# Altium schematic sheet Power.SchDoc
size A
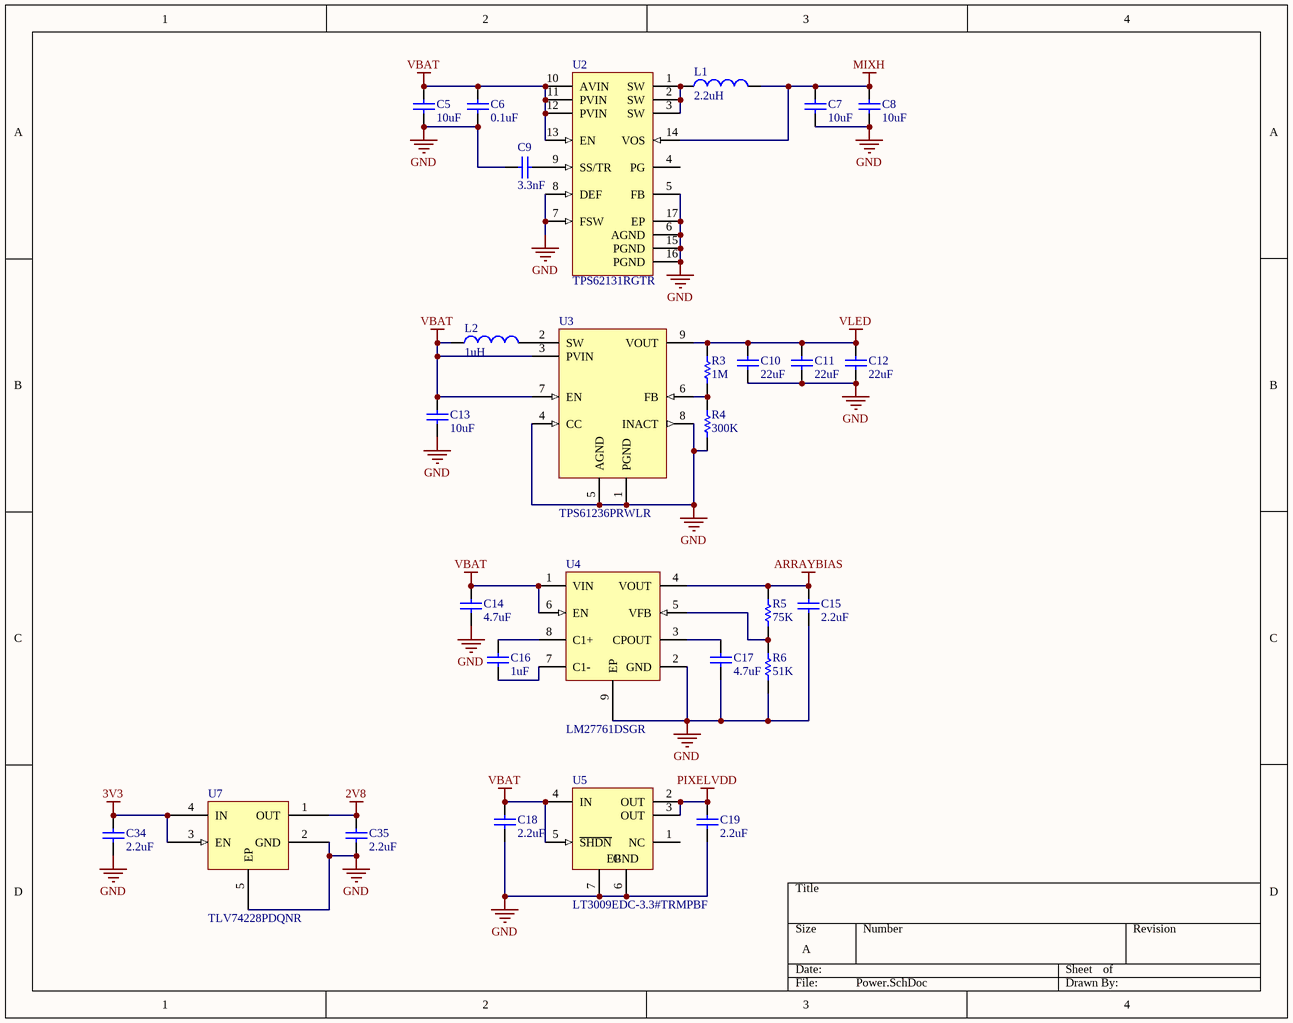
[diagram p0: Power.SchDoc]

## Parts
C5  value 10uF  [C0402[1005X55]]  (hidden comment: 10uF 6.3V 0402)
C6  value 0.1uF  [C0201[0603X30]]  (hidden comment: 0.1uF 6.3V 0201)
C7  value 10uF  [C0402[1005X55]]  (hidden comment: 10uF 6.3V 0402)
C8  value 10uF  [C0402[1005X55]]  (hidden comment: 10uF 6.3V 0402)
C9  value 3.3nF  [C0201[0603X30]]  (hidden comment: 3.3nF 6.3V 0201)
C10  value 22uF  [C0603[1608X92]]  (hidden comment: 22uF 6.3V 0603)
C11  value 22uF  [C0603[1608X92]]  (hidden comment: 22uF 6.3V 0603)
C12  value 22uF  [C0603[1608X92]]  (hidden comment: 22uF 6.3V 0603)
C13  value 10uF  [C0402[1005X55]]  (hidden comment: 10uF 6.3V 0402)
C14  value 4.7uF  [C0402[1005X55]]  (hidden comment: 4.7uF 6.3V 0402)
C15  value 2.2uF  [C0402[1005X55]]  (hidden comment: 2.2uF 6.3V 0402)
C16  value 1uF  [C0402[1005X55]]  (hidden comment: 1uF 6.3V 0402)
C17  value 4.7uF  [C0402[1005X55]]  (hidden comment: 4.7uF 6.3V 0402)
C18  value 2.2uF  [C0402[1005X55]]  (hidden comment: 2.2uF 6.3V 0402)
C19  value 2.2uF  [C0402[1005X55]]  (hidden comment: 2.2uF 6.3V 0402)
C34  value 2.2uF  [C0402[1005X55]]  (hidden comment: 2.2uF 6.3V 0402)
C35  value 2.2uF  [C0402[1005X55]]  (hidden comment: 2.2uF 6.3V 0402)
L1  2.2uH  [IND1008]
L2  1uH  [IND1008]
R3  value 1M  [R0402[1005]]  (hidden comment: 1M 1% 0402)
R4  value 300K  [R0402[1005]]  (hidden comment: 300K 1% 0402)
R5  value 75K  [R0402[1005]]  (hidden comment: 75K 1% 0402)
R6  value 51K  [R0402[1005]]  (hidden comment: 51K 1% 0402)
U2  TPS62131RGTR  [RGT0016C_V]
U3  TPS61236PRWLR  [VQFN-9]
U4  LM27761DSGR  [WSON-8]
U5  LT3009EDC-3.3#TRMPBF  [LT-DC6-6_V]
U7  TLV74228PDQNR  [X2SON-4]

## Nets
2V8: C35.2 U7.1(OUT)
3V3: C34.2 U7.3(EN) U7.4(IN)
ARRAYBIAS: C15.2 R5.2 U4.4(VOUT)
GND: C5.1 C6.1 C7.1 C8.1 C9.1 C10.1 C11.1 C12.1 C13.1 C14.1 C15.1 C17.1 C18.1 C19.1 C34.1 C35.1 R4.1 R6.1 U2.5(FB) U2.6(AGND) U2.7(FSW) U2.8(DEF) U2.15(PGND) U2.16(PGND) U2.17(EP) U3.1(PGND) U3.4(CC) U3.5(AGND) U3.8(INACT) U4.2(GND) U4.9(EP) U5.6(GND) U5.7(EP) U7.2(GND) U7.5(EP)
MIXH: C7.2 C8.2 L1.2 U2.14(VOS)
PIXELVDD: C19.2 U5.2(OUT) U5.3(OUT)
VBAT: C5.2 C6.2 C13.2 C14.2 C18.2 L2.1 U2.10(AVIN) U2.11(PVIN) U2.12(PVIN) U2.13(EN) U3.3(PVIN) U3.7(EN) U4.1(VIN) U4.6(EN) U5.4(IN) U5.5(~{SHDN})
VLED: C10.2 C11.2 C12.2 R3.2 U3.9(VOUT)
NetC9_2: C9.2 U2.9(SS/TR)
NetC16_1: C16.1 U4.7(C1-)
NetC16_2: C16.2 U4.8(C1+)
NetC17_2: C17.2 U4.3(CPOUT)
NetL1_1: L1.1 U2.1(SW) U2.2(SW) U2.3(SW)
NetL2_2: L2.2 U3.2(SW)
NetR3_1: R3.1 R4.2 U3.6(FB)
NetR5_1: R5.1 R6.2 U4.5(VFB)

Not connected (* = marked no-connect by the designer): U2 4(PG); U5 1(NC)

## Library data of the parts
C5 C7 C8 C13 = CAP_10uF_6.3V_0402_20%: 10uF 6.3V 20% 0402 (1005 Metric); PartNumber: GRM155R60J106ME44D; Manufacturer: Murata; Mounting Technology: Surface Mount; PackageReference: 0402; PackageDescription: 0402 (1005 Metric); Voltage: 6.3V; Tolerance: 20%
C6 = CAP_0.1uF_6.3V_0201_10%: 0.1uF 6.3V 10% 0201 (0603 Metric); PartNumber: GRT033R60J104KE01D; Manufacturer: Murata; Mounting Technology: Surface Mount; PackageReference: 0201; PackageDescription: 0201 (0603 Metric); Voltage: 6.3V; Tolerance: 10%
C9 = CAP_3,3nF_6.3V_0201_10%: 3.3nF 6.3V 10% 0201 (0603 Metric); PartNumber: GRM033R70J332KA01D; Manufacturer: Murata; Mounting Technology: Surface Mount; PackageReference: 0201; PackageDescription: 0201 (0603 Metric); Voltage: 6.3V; Tolerance: 10%
C10-C12 = CAP_22uF_6.3V_0603_10%: 22uF 6.3V 10% 0603 (1608 Metric); PartNumber: GRT188R60J226ME13D; Manufacturer: Murata; Mounting Technology: Surface Mount; PackageReference: 0603; PackageDescription: 0603 (1608 Metric); Voltage: 6.3V; Tolerance: 10%
C14 C17 = CAP_4.7uF_6.3V_0402_20%: 4.7uF 6.3V 20% 0402 (1005 Metric); PartNumber: GRM155R60J475ME47D; Manufacturer: Murata; Mounting Technology: Surface Mount; PackageReference: 0402; PackageDescription: 0402 (1005 Metric); Voltage: 6.3V; Tolerance: 20%
C15 C18 C19 C34 C35 = CAP_2.2uF_6.3V_0402_20%: 2.2uF 6.3V 20% 0402 (1005 Metric); PartNumber: GRM155R60J225ME15D; Manufacturer: Murata; Mounting Technology: Surface Mount; PackageReference: 0402; PackageDescription: 0402 (1005 Metric); Voltage: 6.3V; Tolerance: 20%
C16 = CAP_1uF_6.3V_0402_10%: 1uF 6.3V 10% 0402 (1005 Metric); PartNumber: GRM155R70J105KA12D; Manufacturer: Murata; Mounting Technology: Surface Mount; PackageReference: 0402; PackageDescription: 0402 (1005 Metric); Voltage: 6.3V; Tolerance: 10%
L1 = IND_2.2uH_3.3A_1008_20%: 2.2uH 20% 3.3A 1008; PartNumber: DFE252012F-2R2M=P2; Manufacturer: Murata; PackageReference: 1008; PackageDescription: 1008 (2520 metric); Mounting Technology: Surface Mount; Current: 3.3A; Value: 2.2uH
L2 = IND_1uH_4.7A_1008_20%: 1uH 20% 4.7A 1008; PartNumber: DFE252012F-2R2M=P2; Manufacturer: Murata; PackageReference: 1008; PackageDescription: 1008 (2520 metric); Mounting Technology: Surface Mount; Current: 4.7A; Value: 1uH
R3 = RES_1M_0402_1%: 1M 0.063W 1% 0402 (1005 Metric); Manufacturer: KOA Speer; PartNumber: RK73H1ETTP1004F; Tolerance: 1%; Power: 0.063W; Mounting Technology: Surface Mount; PackageReference: 0402; PackageDescription: 0402 (1005 Metric); ComponentLink1Description: Datasheet; ComponentLink1URL: http://www.koaspeer.com/catimages/Products/RK73H/RK73H.pdf
R4 = RES_300K_0402_1%: 300K 0.063W 1% 0402 (1005 Metric); Manufacturer: KOA Speer; PartNumber: RK73H1ETTP3003F; Tolerance: 1%; Power: 0.063W; Mounting Technology: Surface Mount; PackageReference: 0402; PackageDescription: 0402 (1005 Metric); ComponentLink1Description: Datasheet; ComponentLink1URL: http://www.koaspeer.com/catimages/Products/RK73H/RK73H.pdf
R5 = RES_75K_0402_1%: 75K 0.063W 1% 0402 (1005 Metric); Manufacturer: KOA Speer; PartNumber: RK73H1ETTP7502F; Tolerance: 1%; Power: 0.063W; Mounting Technology: Surface Mount; PackageReference: 0402; PackageDescription: 0402 (1005 Metric); ComponentLink1Description: Datasheet; ComponentLink1URL: http://www.koaspeer.com/catimages/Products/RK73H/RK73H.pdf
R6 = RES_51K_0402_1%: 51K 0.063W 1% 0402 (1005 Metric); Manufacturer: KOA Speer; PartNumber: RK73H1ETTP5102F; Tolerance: 1%; Power: 0.063W; Mounting Technology: Surface Mount; PackageReference: 0402; PackageDescription: 0402 (1005 Metric); ComponentLink1Description: Datasheet; ComponentLink1URL: http://www.koaspeer.com/catimages/Products/RK73H/RK73H.pdf
U2 = CMP-0323-00113-2: Buck Step Down Regulator with 3 to 17 V Input and 1.8 V Output, -40 to 85 degC, 16-Pin QFN (RGT), Green (RoHS & no Sb/Br); Manufacturer: Texas Instruments; Duty Cycle(Max)(%): 100; Vin(Max)(V): 17; Switch Current Limit(Typ)(A): 4.2; Iq(Typ)(mA): 0.017; Preset Vout(V): 1.8; Synchronous Rectification: TRUE; SubFamily: Step-Down Regulator; Regulated Outputs(#): 1; Vin(Min)(V): 3; Rating: Catalog; DatasheetVersion: SLVSAG7; ComponentLink2URL: Samples URL:http://www.ti.com/product/tps62131#samples; Topology: Buck; PackageVersion: revH, Oct-2011; Vout(Max)(V): 1.8; PackageDescription: 16-Pin Plastic Quad Flat No-Lead, 3 x 3 mm Body, 0.5 mm Pitch, 1.7 x 1.7 mm Exposed Pad; ComponentLink2Description: URL Link1; Vout(Min)(V): 1.8; Eco-Plan: Green (RoHS & no Sb/Br); ComponentLink1Description: Datasheet; ComponentLink1URL: http://www.ti.com/general/docs/lit/getliterature.tsp?genericPartNumber=TPS62131&fileType=pdf; PackageReference: RGT0016C; PartNumber: TPS62131RGTR; Iout(Max)(A): 3; Code_JEDEC: MO-220; Mounting Technology: Surface Mount
U3 = TPS61236PRWLR: Manufacturer: Texas Instruments; PartNumber: TPS61236PRWLR; PackageReference: VQFN-9; Mounting Technology: Surface Mount
U4 = LM27761DSGR: Switching Voltage Regulators Switch Cap Boost; Manufacturer: Texas Instruments; PartNumber: LM27761DSGR; Mounting Technology: Surface Mount; PackageReference: WSON-8
U5 = CMP-0476-00025-3: 3 uA IQ, 20 mA Low Dropout Linear Regulator, 1.6 to 20 V Vin, 3.3 V Vout, 6-pin SON (DC6-6), -40 to 125 degC, Pb-Free, Mini Tape and Reel; Manufacturer: Linear Technology; Vin Max(V): 20; Isupply(mA): 0.003; Discrete Pass Element: no; Vin Min(V): 1.6; Output Voltage: 3.3 V; Dropout Voltage(V): 0.28; PSRR(dB): 61; Number of Outputs: 1; Noise(uV): 150; PackageReference: DC6-6; PackageVersion: Rev. B, 06/2010; ComponentLink3URL: http://cds.linear.com/docs/en/packaging/DFN_6_05-08-1703.pdf; Code_JEDEC: MO-229; Mounting Technology: Surface Mount; ComponentLink2URL: http://cds.linear.com/docs/en/datasheet/3009fd.pdf; Iout(mA): 20; ComponentLink3Description: Package Specification; Packing: Mini Tape and Reel; ComponentLink1URL: http://www.linear.com/; RoHS: TRUE; DatasheetVersion: Rev. D; ComponentLink1Description: Manufacturer URL; PartNumber: LT3009EDC-3.3#TRMPBF; Shutdown Current(uA): 1; PackageDescription: 6-Pin Plastic DFN, Body 2 x 2 mm, Pitch 0.5 mm; ComponentLink2Description: Datasheet
U7 = TLV74228PDQNR: LDO Voltage Regulators 200mA Small-Size Low-Dropout (LDO) Linear Voltage Regulator 4-X2SON -40 to 125; Manufacturer: Texas Instruments; PartNumber: TLV74218PDQNR; PackageReference: X2SON-4; Mounting Technology: Surface Mount